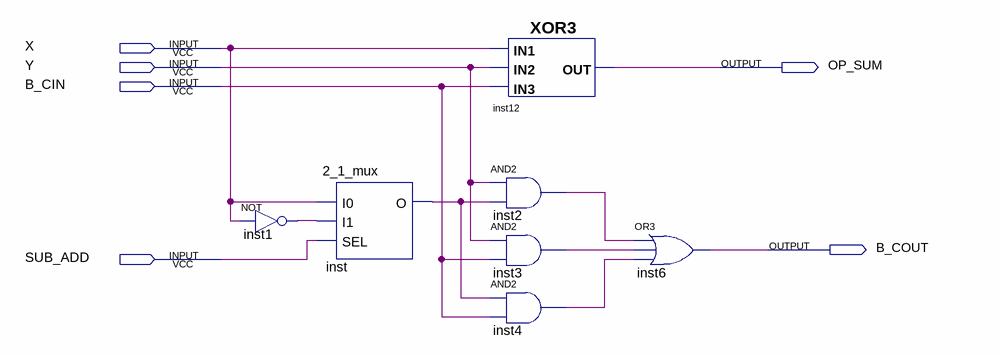
[diagram p0: schematic sheet]
// Quartus schematic fullSubAdd.bdf as structural Verilog: 7 symbols, 6 pins
module fullSubAdd (
  input  X,
  input  Y,
  input  B_CIN,
  input  SUB_ADD,
  output OP_SUM,
  output B_COUT
);

  wire inst1_out, inst2_out, inst3_out, inst4_out, inst_o;

  not inst1 (inst1_out, X);
  \2_1_mux  inst (.I0(X), .I1(inst1_out), .SEL(SUB_ADD), .O(inst_o));
  XOR3 inst12 (.IN3(B_CIN), .IN1(X), .IN2(Y), .OUT(OP_SUM));
  and inst2 (inst2_out, Y, inst_o);
  and inst3 (inst3_out, Y, B_CIN);
  and inst4 (inst4_out, inst_o, B_CIN);
  or inst6 (B_COUT, inst2_out, inst3_out, inst4_out);
endmodule
